# EAGLE board Microcell 1.4 (EAGLE 9.4.2), part 1 of 2
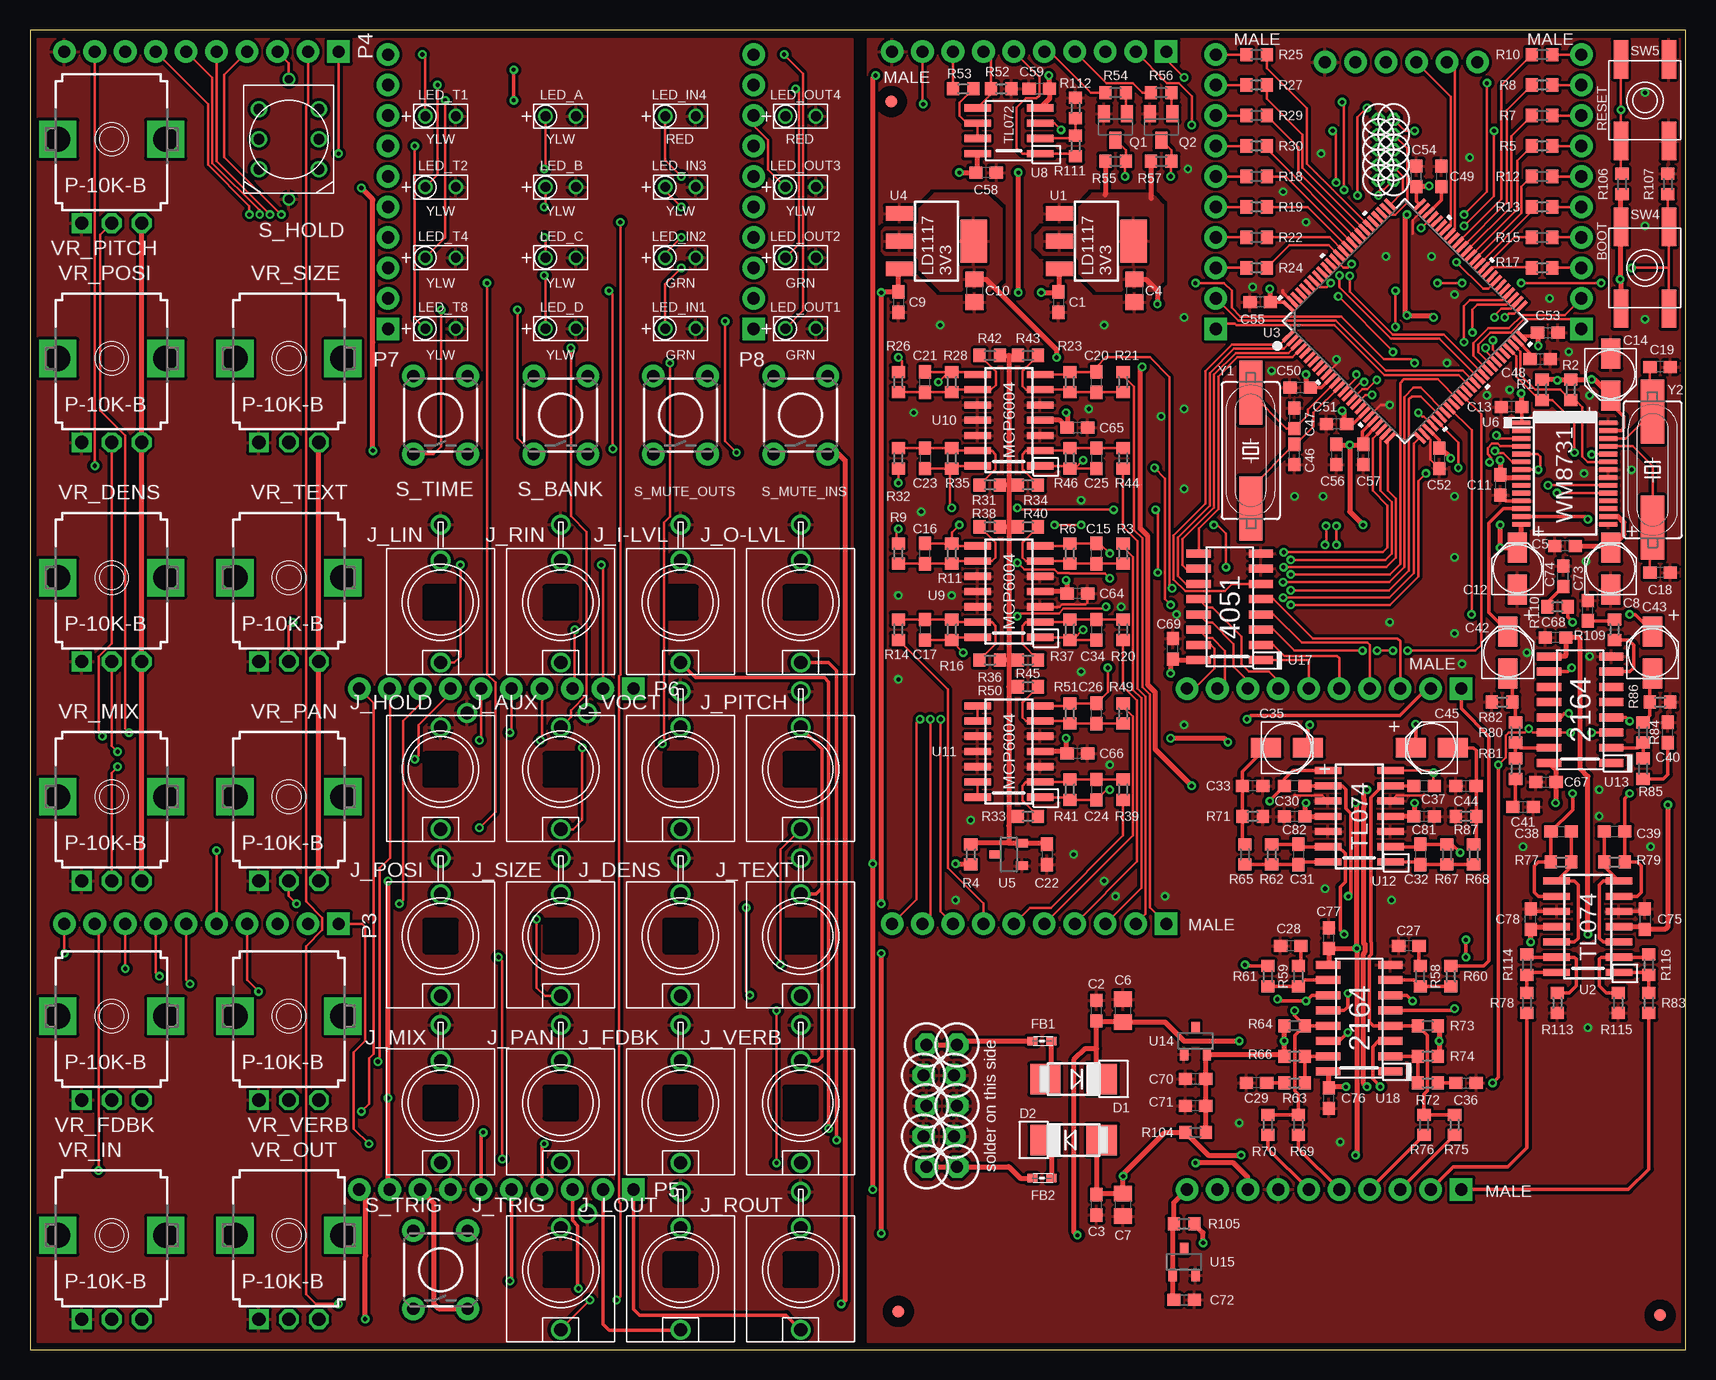
[diagram p5: board, top side]
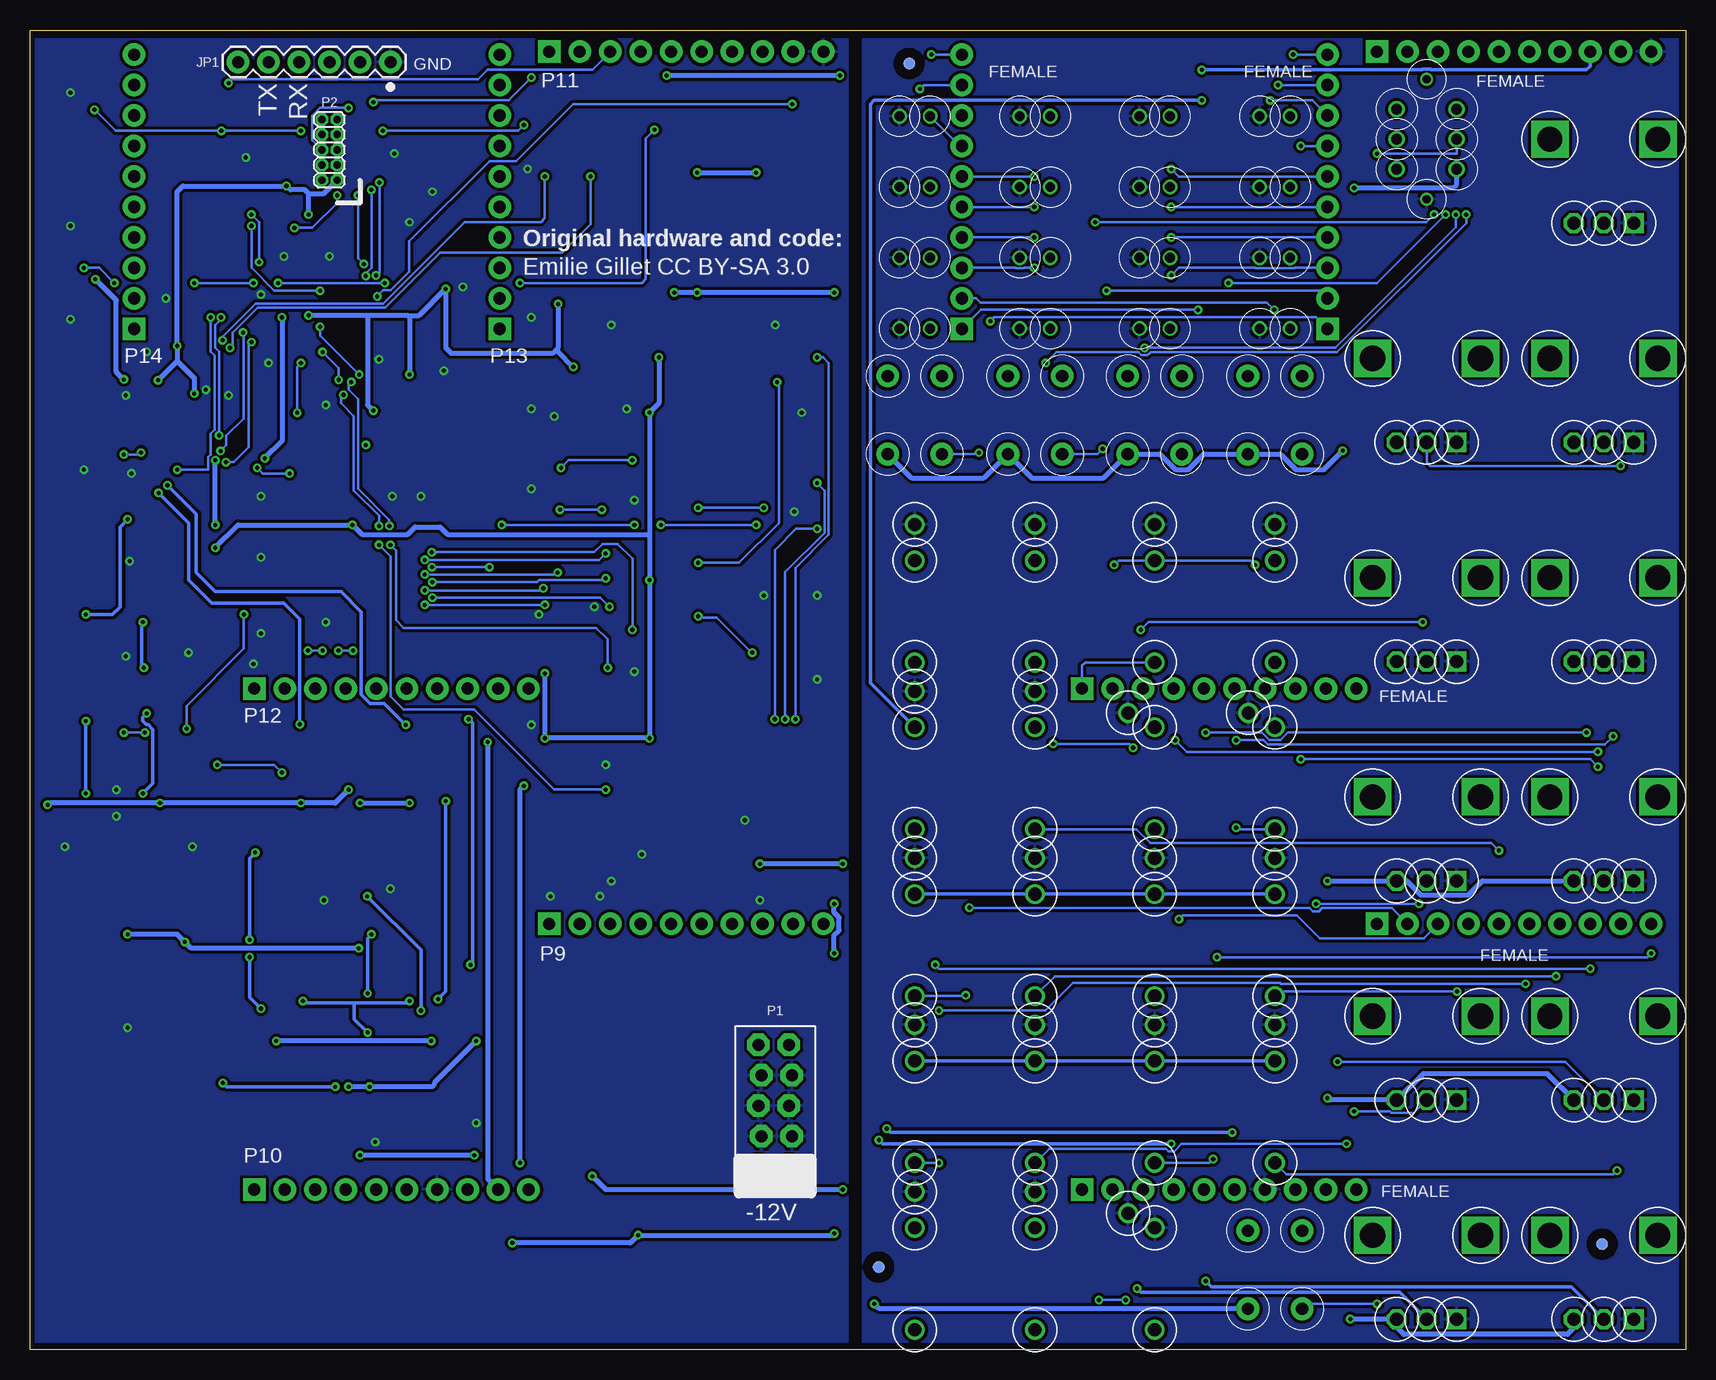
[diagram p6: board, bottom side, seen from below]

Size 138 x 110 mm. Coordinates in mm from the lower left corner, seen from the top.
Outline: 0,0 138,0 138,110 0,110 0,0
Copper layers (1*16): Top 0.0356mm / dielectric 1.5011mm / Bottom 0.0356mm
Design rules "ES_DRC_MaskedVias": minimum track width 6mil, minimum drill 13mil, track to track 6mil, track to pad 6mil, pad to pad 6mil, via to via 6mil, smd to smd 6mil, copper to edge 15mil, drill to drill 6mil, minimum pad ring 7mil, minimum via ring 7mil, stop-mask expansion 3mil, vias tented up to drill 16mil, thermal gap 10mil
Net classes: 0 default: width 0.203 mm; 1 width: width 0.152 mm, clearance 0.152 mm

## Footprints (pad centres in the part's own frame; a part is rotated, then mirrored left to right if it is on the bottom)
C0603 = smd 1.1 x 1: 1 -0.85,0; 2 0.85,0
C0805 = smd 1.3 x 1.5: 1 -0.95,0; 2 0.95,0
EC-4X7 = smd 1.6 x 2.5: P$1 0,1.75; P$2 0,-1.75
SMADIODE = smd 2.54 x 2.54: A 2.349,0; C -2.349,0
WUERTH-ELEKTRONIK_0603 = smd 0.85 x 0.7: 1 -0.9,0; 2 0.7,0
FIDUCIAL_1MM = smd 1 x 1: 1 0,0
S_JACK_SMALL_SILK = drill 1.1: GND -2.223,-4.699; NORM 0,-3.5; TIP 0,5
S_JACK_SILK = drill 1.1: GND 0,-6.5; NORM 0,-3.5; TIP 0,5
1X06 = drill 1.016 pad 1.88: 1 0,0; 2 2.54,0; 3 5.08,0; 4 7.62,0; 5 10.16,0; 6 12.7,0
LED_SILK = drill 0.813: A -1.27,0; K 1.27,0
2X5_LOCK = drill 1.016 pad 1.88 octagon: 1 -1.397,5.08; 2 1.143,5.08; 3 -1.143,2.54; 4 1.397,2.54; 5 -1.397,0; 6 1.143,0; 7 -1.143,-2.54; 8 1.397,-2.54; 9 -1.397,-5.08; 10 1.143,-5.08
2X5-1.27 = drill 0.61 pad 1.067 octagon: 1 -1.27,3.81; 2 0,3.81; 3 -1.27,2.54; 4 0,2.54; 5 -1.27,1.27; 6 0,1.27; 7 -1.27,0; 8 0,0; 9 -1.27,-1.27; 10 0,-1.27
1X10_NO_SILK = drill 1.016 pad 1.88 square: 1 0,0 | drill 1.016 pad 1.88: 2 2.54,0; 3 5.08,0; 4 7.62,0; 5 10.16,0; 6 12.7,0; 7 15.24,0; 8 17.78,0; 9 20.32,0; 10 22.86,0
SOT23-BEC = smd 1 x 1.4: B -0.95,-1.1; C 0,1.1; E 0.95,-1.1
R0603 = smd 1 x 1.1: 1 -0.85,0; 2 0.85,0
TACTILE-PTH_SILK = drill 1.016 pad 1.88: 1 -3.251,2.261; 2 3.251,2.261; 3 -3.251,-2.261; 4 3.251,-2.261
LED_BUTTON_SILK = drill 0.9: 1 -2.5,2.5; 2 -2.5,0; 3 -2.5,-2.5; 4 2.5,2.5; 5 2.5,0; 6 2.5,-2.5 | drill 0.7: LED_A 0,5; LED_K 0,-5
EVQ-Q2 = smd 3.2 x 1.2: A -3.4,-2; A' 3.4,-2; B -3.4,2; B' 3.4,2
SOT223 = smd 2.235 x 1.219: 1 3.099,-2.311; 2 3.099,0; 3 3.099,2.311 | smd 2.2 x 3.6: TAB -3.099,0
SO-14 = smd 0.6 x 2.2: 1 -3.81,-2.6; 2 -2.54,-2.6; 3 -1.27,-2.6; 4 0,-2.6; 5 1.27,-2.6; 6 2.54,-2.6; 7 3.81,-2.6; 8 3.81,2.6; 9 2.54,2.6; 10 1.27,2.6; 11 0,2.6; 12 -1.27,2.6; 13 -2.54,2.6; 14 -3.81,2.6
LQFP100-14X14MM = smd 0.305 x 1.194: 1 -6,-7.75; 2 -5.5,-7.75; 3 -5,-7.75; 4 -4.5,-7.75; 5 -4,-7.75; 6 -3.5,-7.75; 7 -3,-7.75; 8 -2.5,-7.75; 9 -2,-7.75; 10 -1.5,-7.75; 11 -1,-7.75; 12 -0.5,-7.75; 13 0,-7.75; 14 0.5,-7.75; 15 1,-7.75; 16 1.5,-7.75; 17 2,-7.75; 18 2.5,-7.75; 19 3,-7.75; 20 3.5,-7.75; 21 4,-7.75; 22 4.5,-7.75; 23 5,-7.75; 24 5.5,-7.75; 25 6,-7.75; 51 6,7.75; 52 5.5,7.75; 53 5,7.75; 54 4.5,7.75; 55 4,7.75; 56 3.5,7.75; 57 3,7.75; 58 2.5,7.75; 59 2,7.75; 60 1.5,7.75; 61 1,7.75; 62 0.5,7.75; 63 0,7.75; 64 -0.5,7.75; 65 -1,7.75; 66 -1.5,7.75; 67 -2,7.75; 68 -2.5,7.75; 69 -3,7.75; 70 -3.5,7.75; 71 -4,7.75; 72 -4.5,7.75; 73 -5,7.75; 74 -5.5,7.75; 75 -6,7.75 | smd 1.194 x 0.305: 26 7.75,-6; 27 7.75,-5.5; 28 7.75,-5; 29 7.75,-4.5; 30 7.75,-4; 31 7.75,-3.5; 32 7.75,-3; 33 7.75,-2.5; 34 7.75,-2; 35 7.75,-1.5; 36 7.75,-1; 37 7.75,-0.5; 38 7.75,0; 39 7.75,0.5; 40 7.75,1; 41 7.75,1.5; 42 7.75,2; 43 7.75,2.5; 44 7.75,3; 45 7.75,3.5; 46 7.75,4; 47 7.75,4.5; 48 7.75,5; 49 7.75,5.5; 50 7.75,6; 76 -7.75,6; 77 -7.75,5.5; 78 -7.75,5; 79 -7.75,4.5; 80 -7.75,4; 81 -7.75,3.5; 82 -7.75,3; 83 -7.75,2.5; 84 -7.75,2; 85 -7.75,1.5; 86 -7.75,1; 87 -7.75,0.5; 88 -7.75,0; 89 -7.75,-0.5; 90 -7.75,-1; 91 -7.75,-1.5; 92 -7.75,-2; 93 -7.75,-2.5; 94 -7.75,-3; 95 -7.75,-3.5; 96 -7.75,-4; 97 -7.75,-4.5; 98 -7.75,-5; 99 -7.75,-5.5; 100 -7.75,-6
DBZ_R-PDSO-G3 = smd 0.7 x 1: 1 -0.95,-1.1; 2 0.95,-1.1; 3 0,1.1
SSOP-28 = smd 0.4 x 1.5: 1 -4.225,-3.625; 2 -3.575,-3.625; 3 -2.925,-3.625; 4 -2.275,-3.625; 5 -1.625,-3.625; 6 -0.975,-3.625; 7 -0.325,-3.625; 8 0.325,-3.625; 9 0.975,-3.625; 10 1.625,-3.625; 11 2.275,-3.625; 12 2.925,-3.625; 13 3.575,-3.625; 14 4.225,-3.625; 15 4.225,3.625; 16 3.575,3.625; 17 2.925,3.625; 18 2.275,3.625; 19 1.625,3.625; 20 0.975,3.625; 21 0.325,3.625; 22 -0.325,3.625; 23 -0.975,3.625; 24 -1.625,3.625; 25 -2.275,3.625; 26 -2.925,3.625; 27 -3.575,3.625; 28 -4.225,3.625
SO-8 = smd 0.61 x 2.21: 1 -1.905,-2.616; 2 -0.635,-2.616; 3 0.635,-2.616; 4 1.905,-2.616; 5 1.905,2.616; 6 0.635,2.616; 7 -0.635,2.616; 8 -1.905,2.616
SO-16 = smd 0.66 x 2.032: 1 -4.445,-2.591; 2 -3.175,-2.591; 3 -1.905,-2.591; 4 -0.635,-2.591; 5 0.635,-2.591; 6 1.905,-2.591; 7 3.175,-2.591; 8 4.445,-2.591; 9 4.445,2.591; 10 3.175,2.591; 11 1.905,2.591; 12 0.635,2.591; 13 -0.635,2.591; 14 -1.905,2.591; 15 -3.175,2.591; 16 -4.445,2.591
9MM_SNAP-IN_POT_SILK = drill 1.1 square: 1 -2.5,-7 | drill 1.1 octagon: 2 0,-7; 3 2.5,-7 | drill 2.1 square: CHASSIS1 -4.5,0; CHASSIS2 4.5,0
HC49UP = smd 5.334 x 1.93: 1 -4.826,0; 2 4.826,0

## Placement (x,y rotation side)
C1  100NF  [C0603]  85.72,87.31 270 top
C2  100NF  [C0603]  88.9,28.26 90 top
C3  100NF  [C0603]  88.9,12.06 90 top
C4  10UF  [C0805]  92.08,88.27 270 top
C5  100NF  [C0603]  127.95,66.99 180 top
C6  10UF  [C0805]  91.12,28.26 90 top
C7  10UF  [C0805]  91.12,12.06 90 top
C8  10UF  [EC-4X7]  131.76,65.09 0 top
C9  100NF  [C0603]  72.39,87.31 270 top
C10  10UF  [C0805]  78.74,88.27 270 top
C11  100NF  [C0603]  122.56,72.07 270 top
C12  10UF  [EC-4X7]  123.98,65.09 0 top
C13  100NF  [C0603]  123.51,78.58 180 top
C14  10UF  [EC-4X7]  131.76,81.28 180 top
C15  10NF  [C0603]  88.9,66.36 90 top
C16  10NF  [C0603]  74.61,66.36 90 top
C17  10NF  [C0603]  74.61,60.01 270 top
C18  18PF  [C0603]  135.89,64.77 180 top
C19  18PF  [C0603]  135.89,81.92 180 top
C20  10NF  [C0603]  88.9,80.64 90 top
C21  10NF  [C0603]  74.61,80.64 90 top
C22  100NF  [C0603]  84.77,41.27 270 top
C23  10NF  [C0603]  74.61,74.3 270 top
C24  10NF  [C0603]  88.9,46.67 270 top
C25  10NF  [C0603]  88.9,74.3 270 top
C26  1NF  [C0603]  88.9,53.02 90 top
C27  560PF  [C0603]  114.94,33.66 180 top
C28  560PF  [C0603]  105.09,33.66 180 top
C29  560PF  [C0603]  102.23,22.23 180 top
C30  47PF  [C0603]  105.41,46.99 180 top
C31  47PF  [C0603]  105.73,41.27 270 top
C32  47PF  [C0603]  115.89,41.27 270 top
C33  220PF  [C0603]  101.92,46.99 180 top
C34  10NF  [C0603]  88.9,60.01 270 top
C35  10UF  [EC-4X7]  104.78,50.16 270 top
C36  560PF  [C0603]  119.7,22.23 0 top
C37  47PF  [C0603]  116.2,46.99 0 top
C38  47PF  [C0603]  127.64,43.18 0 top
C39  47PF  [C0603]  132.08,43.18 180 top
C40  560PF  [C0603]  136.53,51.44 90 top
C41  560PF  [C0603]  124.46,45.24 0 top
C42  10UF  [EC-4X7]  123.19,58.1 0 top
C43  10UF  [EC-4X7]  135.25,58.1 0 top
C44  220PF  [C0603]  119.7,46.99 0 top
C45  10UF  [EC-4X7]  116.84,50.16 90 top
C46  18PF  [C0603]  105.41,74.61 90 top
C47  18PF  [C0603]  105.41,77.63 270 top
C48  2.2UF  [C0603]  125.89,82.55 180 top
C49  2.2UF  [C0603]  117.63,97.79 270 top
C50  100NF  [C0603]  105.89,80.17 180 top
C51  100NF  [C0603]  108.9,77.15 180 top
C52  100NF  [C0603]  117.47,74.3 270 top
C53  100NF  [C0603]  126.52,84.77 0 top
C54  100NF  [C0603]  115.57,97.79 90 top
C55  100NF  [C0603]  102.55,87.31 180 top
C56  100NF  [C0603]  108.9,74.61 270 top
C57  100NF  [C0603]  111.12,74.61 270 top
C58  100NF  [C0603]  79.69,98.11 180 top
C59  100NF  [C0603]  84.14,105.09 180 top
C64  100NF  [C0603]  87.31,63.02 180 top
C65  100NF  [C0603]  87.31,76.83 180 top
C66  100NF  [C0603]  87.31,49.69 180 top
C67  100NF  [C0603]  126.36,47.31 0 top
C68  100NF  [C0603]  127.16,59.37 180 top
C69  100NF  [C0603]  95.25,58.42 90 top
C70  470NF  [C0603]  97.16,22.54 180 top
C71  470NF  [C0603]  97.16,20.32 180 top
C72  100NF  [C0603]  96.2,4.13 0 top
C73  560PF  [C0603]  129.86,61.59 90 top
C74  560PF  [C0603]  127.79,64.45 90 top
C75  100NF  [C0603]  134.62,35.88 270 top
C76  100NF  [C0603]  108.27,20.95 90 top
C77  100NF  [C0603]  108.27,34.29 90 top
C78  100NF  [C0603]  125.09,35.88 90 top
C81  100NF  [C0603]  116.2,44.45 180 top
C82  100NF  [C0603]  105.41,44.45 180 top
D1  S1B  [SMADIODE]  87,22.54 180 top
D2  S1B  [SMADIODE]  87,17.46 0 top
FB1  FB  [WUERTH-ELEKTRONIK_0603]  84.45,25.72 0 top
FB2  FB  [WUERTH-ELEKTRONIK_0603]  84.45,14.29 0 top
FD1  FIDUCIAL  [FIDUCIAL_1MM]  67.27,6.88 0 bottom
FD2  FIDUCIAL  [FIDUCIAL_1MM]  6.94,8.78 0 bottom
FD3  FIDUCIAL  [FIDUCIAL_1MM]  64.72,107.2 0 bottom
FD4  FIDUCIAL  [FIDUCIAL_1MM]  135.89,2.86 0 top
FD5  FIDUCIAL  [FIDUCIAL_1MM]  72.39,3.17 0 top
FD6  FIDUCIAL  [FIDUCIAL_1MM]  71.8,104.03 0 top
J_AUX  Eurorack Jack  [S_JACK_SMALL_SILK]  44.24,48.37 180 top
J_DENS  Eurorack Jack  [S_JACK_SILK]  54.22,34.47 180 top
J_FDBK  Eurorack Jack  [S_JACK_SILK]  54.22,20.56 180 top
J_HOLD  Eurorack Jack  [S_JACK_SMALL_SILK]  34.22,48.37 180 top
J_I-LVL  Eurorack Jack  [S_JACK_SILK]  54.22,62.28 180 top
J_LIN  Eurorack Jack  [S_JACK_SILK]  34.22,62.28 180 top
J_LOUT  Eurorack Jack  [S_JACK_SILK]  54.22,6.65 180 top
J_MIX  Eurorack Jack  [S_JACK_SILK]  34.22,20.56 180 top
J_O-LVL  Eurorack Jack  [S_JACK_SILK]  64.24,62.28 180 top
J_PAN  Eurorack Jack  [S_JACK_SILK]  44.24,20.56 180 top
J_PITCH  Eurorack Jack  [S_JACK_SILK]  64.24,48.37 180 top
J_POSI  Eurorack Jack  [S_JACK_SILK]  34.22,34.47 180 top
J_RIN  Eurorack Jack  [S_JACK_SILK]  44.24,62.28 180 top
J_ROUT  Eurorack Jack  [S_JACK_SILK]  64.24,6.65 180 top
J_SIZE  Eurorack Jack  [S_JACK_SILK]  44.24,34.47 180 top
J_TEXT  Eurorack Jack  [S_JACK_SILK]  64.24,34.47 180 top
J_TRIG  Eurorack Jack  [S_JACK_SMALL_SILK]  44.24,6.65 180 top
J_VERB  Eurorack Jack  [S_JACK_SILK]  64.24,20.56 180 top
J_VOCT  Eurorack Jack  [S_JACK_SILK]  54.22,48.37 180 top
JP1  1X6 Male PTH Header  [1X06]  107.95,107.31 180 bottom
LED_A  3mm Yellow Diffused  [LED_SILK]  44.24,102.81 0 top
LED_B  3mm Yellow Diffused  [LED_SILK]  44.24,96.91 0 top
LED_C  3mm Yellow Diffused  [LED_SILK]  44.24,91.01 0 top
LED_D  3mm Yellow Diffused  [LED_SILK]  44.24,85.11 0 top
LED_IN1  3mm Green Diffused  [LED_SILK]  54.22,85.11 0 top
LED_IN2  3mm Green Diffused  [LED_SILK]  54.22,91.01 0 top
LED_IN3  3mm Yellow Diffused  [LED_SILK]  54.22,96.91 0 top
LED_IN4  3mm Red Diffused  [LED_SILK]  54.22,102.81 0 top
LED_OUT1  3mm Green Diffused  [LED_SILK]  64.24,85.11 0 top
LED_OUT2  3mm Green Diffused  [LED_SILK]  64.24,91.01 0 top
LED_OUT3  3mm Yellow Diffused  [LED_SILK]  64.24,96.91 0 top
LED_OUT4  3mm Red Diffused  [LED_SILK]  64.24,102.81 0 top
LED_T1  3mm Yellow Diffused  [LED_SILK]  34.22,102.81 0 top
LED_T2  3mm Yellow Diffused  [LED_SILK]  34.22,96.91 0 top
LED_T4  3mm Yellow Diffused  [LED_SILK]  34.22,91.01 0 top
LED_T8  3mm Yellow Diffused  [LED_SILK]  34.22,85.11 0 top
P1  2X5 Male PTH Header  [2X5_LOCK]  75.88,20.32 0 bottom
P2  Mini JTAG Header  [2X5-1.27]  113.67,101.28 180 bottom
P3  1X10 Female PTH header  [1X10_NO_SILK]  25.72,35.48 180 top
P4  1X10 Female PTH header  [1X10_NO_SILK]  25.72,108.19 180 top
P5  1X10 Female PTH header  [1X10_NO_SILK]  50.3,13.34 180 top
P6  1X10 Female PTH header  [1X10_NO_SILK]  50.3,55.1 180 top
P7  1X10 Female PTH header  [1X10_NO_SILK]  29.84,85.09 90 top
P8  1X10 Female PTH header  [1X10_NO_SILK]  60.33,85.09 90 top
P9  1X10 Male PTH header  [1X10_NO_SILK]  94.72,35.48 180 top
P10  1X10 Male PTH header  [1X10_NO_SILK]  119.3,13.34 180 top
P11  1X10 Male PTH header  [1X10_NO_SILK]  94.72,108.19 180 top
P12  1X10 Male PTH header  [1X10_NO_SILK]  119.3,55.1 180 top
P13  1X10 Male PTH header  [1X10_NO_SILK]  98.84,85.09 90 top
P14  1X10 Male PTH header  [1X10_NO_SILK]  129.32,85.09 90 top
Q1  MMBT3904  [SOT23-BEC]  90.49,101.92 180 top
Q2  MMBT3904  [SOT23-BEC]  94.3,101.92 180 top
R1  2K  [R0603]  126.05,80.01 90 top
R2  2K  [R0603]  128.43,80.01 90 top
R3  100K  [R0603]  91.12,66.36 270 top
R4  510R  [R0603]  78.42,41.27 90 top
R5  1K  [R0603]  126.05,100.33 180 top
R6  33K  [R0603]  86.68,66.36 90 top
R7  1K  [R0603]  126.05,102.87 180 top
R8  100R  [R0603]  126.05,105.41 180 top
R9  100K  [R0603]  72.39,66.36 270 top
R10  100R  [R0603]  126.05,107.95 180 top
R11  33K  [R0603]  76.83,66.36 90 top
R12  1K  [R0603]  126.05,97.79 180 top
R13  1K  [R0603]  126.05,95.25 180 top
R14  100K  [R0603]  72.39,60.01 90 top
R15  100R  [R0603]  126.05,92.71 180 top
R16  33K  [R0603]  76.83,60.01 270 top
R17  100R  [R0603]  126.05,90.17 180 top
R18  1K  [R0603]  102.23,97.79 0 top
R19  1K  [R0603]  102.23,95.25 0 top
R20  100K  [R0603]  91.12,60.01 90 top
R21  100K  [R0603]  91.12,80.64 270 top
R22  1K  [R0603]  102.23,92.71 0 top
R23  33K  [R0603]  86.68,80.64 90 top
R24  1K  [R0603]  102.23,90.17 0 top
R25  1K  [R0603]  102.23,107.95 0 top
R26  100K  [R0603]  72.39,80.64 270 top
R27  1K  [R0603]  102.23,105.41 0 top
R28  33K  [R0603]  76.83,80.64 90 top
R29  1K  [R0603]  102.23,102.87 0 top
R30  1K  [R0603]  102.23,100.33 0 top
R31  200K  [R0603]  80.01,72.07 180 top
R32  100K  [R0603]  72.39,74.3 90 top
R33  200K  [R0603]  83.19,44.45 0 top
R34  200K  [R0603]  83.19,72.07 0 top
R35  33K  [R0603]  76.83,74.3 270 top
R36  200K  [R0603]  80.01,57.47 180 top
R37  33K  [R0603]  86.68,60.01 270 top
R38  200K  [R0603]  80.01,68.58 180 top
R39  100K  [R0603]  91.12,46.67 90 top
R40  200K  [R0603]  83.19,68.58 0 top
R41  33K  [R0603]  86.68,46.67 270 top
R42  200K  [R0603]  80.01,82.87 180 top
R43  200K  [R0603]  83.19,82.87 0 top
R44  100K  [R0603]  91.12,74.3 90 top
R45  200K  [R0603]  83.19,57.47 0 top
R46  33K  [R0603]  86.68,74.3 270 top
R49  100K  [R0603]  91.12,53.02 270 top
R50  180K  [R0603]  83.19,55.24 0 top
R51  47K  [R0603]  86.68,53.02 90 top
R52  1M  [R0603]  80.96,105.09 180 top
R53  100R  [R0603]  77.79,105.09 0 top
R54  100K  [R0603]  90.49,104.78 0 top
R55  100K  [R0603]  90.49,99.06 180 top
R56  100K  [R0603]  94.3,104.78 0 top
R57  100K  [R0603]  94.3,99.06 180 top
R58  510R  [R0603]  115.89,31.11 270 top
R59  510R  [R0603]  105.73,31.11 270 top
R60  22K  [R0603]  118.43,31.11 90 top
R61  22K  [R0603]  103.19,31.11 90 top
R62  10K  [R0603]  103.5,41.27 90 top
R63  510R  [R0603]  105.41,22.23 0 top
R64  1M  [R0603]  105.41,26.99 180 top
R65  5K1  [R0603]  101.28,41.27 270 top
R66  49K9  [R0603]  105.41,24.45 180 top
R67  10K  [R0603]  118.11,41.27 90 top
R68  5K1  [R0603]  120.33,41.27 270 top
R69  100K  [R0603]  105.73,18.73 270 top
R70  100K  [R0603]  103.19,18.73 270 top
R71  10K  [R0603]  101.92,44.45 0 top
R72  510R  [R0603]  116.52,22.23 180 top
R73  1M  [R0603]  116.52,26.99 0 top
R74  49K9  [R0603]  116.52,24.45 0 top
R75  100K  [R0603]  118.75,18.73 270 top
R76  100K  [R0603]  116.2,18.73 270 top
R77  200K  [R0603]  127.64,40.64 180 top
R78  1K  [R0603]  124.78,28.89 90 top
R79  200K  [R0603]  132.08,40.64 0 top
R80  22K  [R0603]  123.83,51.44 90 top
R81  510R  [R0603]  123.83,48.42 90 top
R82  39K  [R0603]  122.71,53.98 180 top
R83  1K  [R0603]  134.94,28.89 90 top
R84  22K  [R0603]  134.46,51.44 90 top
R85  510R  [R0603]  134.46,48.42 90 top
R86  39K  [R0603]  135.89,53.98 0 top
R87  10K  [R0603]  119.7,44.45 180 top
R104  22K  [R0603]  97.16,18.1 0 top
R105  510R  [R0603]  96.2,10.48 180 top
R106  10K  [R0603]  132.72,97.16 270 top
R107  10K  [R0603]  136.53,97.16 270 top
R109  510R  [R0603]  132.08,60.01 270 top
R110  510R  [R0603]  127.32,61.91 0 top
R111  100K  [R0603]  87.15,100.33 90 top
R112  200K  [R0603]  87.15,103.5 90 top
R113  100K  [R0603]  127.32,28.89 270 top
R114  100K  [R0603]  124.78,32.07 270 top
R115  100K  [R0603]  132.4,28.89 270 top
R116  100K  [R0603]  134.94,32.07 270 top
S_BANK  Mini Button  [TACTILE-PTH_SILK]  44.24,77.9 90 top
S_HOLD  LED Button White  [LED_BUTTON_SILK]  21.58,100.89 0 top
S_MUTE_INS  Mini Button  [TACTILE-PTH_SILK]  64.24,77.9 90 top
S_MUTE_OUTS  Mini Button  [TACTILE-PTH_SILK]  54.22,77.9 90 top
S_TIME  Mini Button  [TACTILE-PTH_SILK]  34.22,77.9 90 top
S_TRIG  Mini Button  [TACTILE-PTH_SILK]  34.22,6.65 90 top
SW4  EVQ-Q2  [EVQ-Q2]  134.62,90.17 90 top
SW5  EVQ-Q2  [EVQ-Q2]  134.62,104.14 90 top
U1  LD1117-3V3  [SOT223]  88.9,92.39 180 top
U2  TL074  [SO-14]  129.86,35.24 90 top
U3  STM32F427VIT6  [LQFP100-14X14MM]  114.62,85.72 315 top
U4  LD1117-3V3  [SOT223]  75.56,92.39 180 top
U5  LM4040-10V  [DBZ_R-PDSO-G3]  81.6,41.27 90 top
U6  WM8731  [SSOP-28]  127.95,73.03 270 top
U8  TL072  [SO-8]  81.6,101.6 90 top
U9  MCP6004  [SO-14]  81.6,63.18 90 top
U10  MCP6004  [SO-14]  81.6,77.47 90 top
U11  MCP6004  [SO-14]  81.6,49.85 90 top
U12  TL074  [SO-14]  110.81,44.45 90 top
U13  2164  [SO-16]  129.22,53.34 90 top
U14  LM4040-2V5  [DBZ_R-PDSO-G3]  97.16,25.72 0 top
U15  LM4040-10V  [DBZ_R-PDSO-G3]  96.2,7.3 0 top
U17  4051  [SO-16]  100.01,61.91 90 top
U18  2164  [SO-16]  110.81,27.62 90 top
VR_DENS  P-10K-B  [9MM_SNAP-IN_POT_SILK]  6.81,64.34 0 top
VR_FDBK  P-10K-B  [9MM_SNAP-IN_POT_SILK]  6.81,27.8 0 top
VR_IN  P-10K-B  [9MM_SNAP-IN_POT_SILK]  6.81,9.52 0 top
VR_MIX  P-10K-B  [9MM_SNAP-IN_POT_SILK]  6.81,46.07 0 top
VR_OUT  P-10K-B  [9MM_SNAP-IN_POT_SILK]  21.58,9.52 0 top
VR_PAN  P-10K-B  [9MM_SNAP-IN_POT_SILK]  21.58,46.07 0 top
VR_PITCH  P-10K-B  [9MM_SNAP-IN_POT_SILK]  6.81,100.89 0 top
VR_POSI  P-10K-B  [9MM_SNAP-IN_POT_SILK]  6.81,82.62 0 top
VR_SIZE  P-10K-B  [9MM_SNAP-IN_POT_SILK]  21.58,82.62 0 top
VR_TEXT  P-10K-B  [9MM_SNAP-IN_POT_SILK]  21.58,64.34 0 top
VR_VERB  P-10K-B  [9MM_SNAP-IN_POT_SILK]  21.58,27.8 0 top
Y1  8MHZ HC49/US  [HC49UP]  101.76,74.93 90 top
Y2  12.288MHz  [HC49UP]  135.25,73.34 270 top